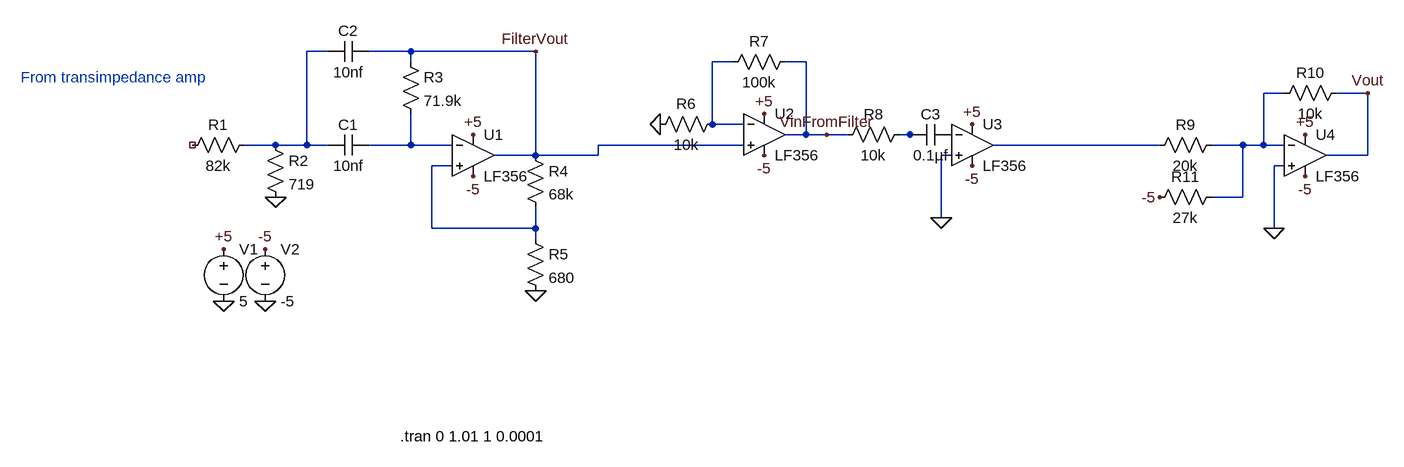
[diagram p0: schematic SecondOrderFilter.asc]
SecondOrderFilter.asc, the LTspice schematic file:
Version 4
SHEET 1 1868 680
WIRE 224 -16 192 -16
WIRE 352 -16 288 -16
WIRE 544 -16 352 -16
WIRE 352 0 352 -16
WIRE 848 0 816 0
WIRE 960 0 928 0
WIRE 1696 48 1664 48
WIRE 1824 48 1776 48
WIRE 816 96 816 0
WIRE 864 96 816 96
WIRE 960 112 960 0
WIRE 960 112 928 112
WIRE 992 112 960 112
WIRE 1024 112 992 112
WIRE 1120 112 1104 112
WIRE 1136 112 1120 112
WIRE 144 128 96 128
WIRE 192 128 192 -16
WIRE 192 128 144 128
WIRE 224 128 192 128
WIRE 352 128 352 80
WIRE 352 128 288 128
WIRE 416 128 352 128
WIRE 864 128 640 128
WIRE 1504 128 1248 128
WIRE 1632 128 1584 128
WIRE 1664 128 1664 48
WIRE 1664 128 1632 128
WIRE 1696 128 1664 128
WIRE 544 144 544 -16
WIRE 544 144 480 144
WIRE 640 144 640 128
WIRE 640 144 544 144
WIRE 1184 144 1168 144
WIRE 1824 144 1824 48
WIRE 1824 144 1760 144
WIRE 416 160 384 160
WIRE 1696 160 1680 160
WIRE 1632 208 1632 128
WIRE 1632 208 1584 208
WIRE 1168 240 1168 144
WIRE 384 256 384 160
WIRE 544 256 544 224
WIRE 544 256 384 256
WIRE 1680 256 1680 160
WIRE 544 272 544 256
FLAG 544 352 0
FLAG 144 208 0
FLAG 128 368 0
FLAG 64 368 0
FLAG 64 288 +5
FLAG 128 288 -5
FLAG 448 176 -5
FLAG 448 112 +5
FLAG 544 -16 FilterVout
FLAG 736 96 0
FLAG 896 80 +5
FLAG 896 144 -5
FLAG 1168 240 0
FLAG 1680 256 0
FLAG 1216 160 -5
FLAG 1504 208 -5
FLAG 1728 176 -5
FLAG 1216 96 +5
FLAG 1728 112 +5
FLAG 1824 48 Vout
FLAG 992 112 VinFromFilter
SYMBOL res 112 112 R90
WINDOW 0 0 56 VBottom 2
WINDOW 3 32 56 VTop 2
SYMATTR InstName R1
SYMATTR Value 82k
SYMBOL res 128 112 R0
SYMATTR InstName R2
SYMATTR Value 719
SYMBOL cap 288 112 R90
WINDOW 0 0 32 VBottom 2
WINDOW 3 32 32 VTop 2
SYMATTR InstName C1
SYMATTR Value 10nf
SYMBOL cap 288 -32 R90
WINDOW 0 0 32 VBottom 2
WINDOW 3 32 32 VTop 2
SYMATTR InstName C2
SYMATTR Value 10nf
SYMBOL res 336 -16 R0
SYMATTR InstName R3
SYMATTR Value 71.9k
SYMBOL OpAmps\\LF356 448 80 R0
SYMATTR InstName U1
SYMBOL res 528 128 R0
SYMATTR InstName R4
SYMATTR Value 68k
SYMBOL res 528 256 R0
SYMATTR InstName R5
SYMATTR Value 680
SYMBOL voltage 64 272 R0
WINDOW 123 0 0 Left 0
WINDOW 39 0 0 Left 0
SYMATTR InstName V1
SYMATTR Value 5
SYMBOL voltage 128 272 R0
WINDOW 123 0 0 Left 0
WINDOW 39 0 0 Left 0
SYMATTR InstName V2
SYMATTR Value -5
SYMBOL OpAmps\\LF356 896 48 R0
SYMATTR InstName U2
SYMBOL res 832 80 R90
WINDOW 0 0 56 VBottom 2
WINDOW 3 32 56 VTop 2
SYMATTR InstName R6
SYMATTR Value 10k
SYMBOL res 944 -16 R90
WINDOW 0 0 56 VBottom 2
WINDOW 3 32 56 VTop 2
SYMATTR InstName R7
SYMATTR Value 100k
SYMBOL res 1120 96 R90
WINDOW 0 0 56 VBottom 2
WINDOW 3 32 56 VTop 2
SYMATTR InstName R8
SYMATTR Value 10k
SYMBOL cap 1184 96 R90
WINDOW 0 0 32 VBottom 2
WINDOW 3 32 32 VTop 2
SYMATTR InstName C3
SYMATTR Value 0.1µf
SYMBOL OpAmps\\LF356 1216 64 R0
SYMATTR InstName U3
SYMBOL res 1600 112 R90
WINDOW 0 0 56 VBottom 2
WINDOW 3 32 56 VTop 2
SYMATTR InstName R9
SYMATTR Value 20k
SYMBOL res 1600 192 R90
WINDOW 0 0 56 VBottom 2
WINDOW 3 32 56 VTop 2
SYMATTR InstName R11
SYMATTR Value 27k
SYMBOL OpAmps\\LF356 1728 80 R0
SYMATTR InstName U4
SYMBOL res 1792 32 R90
WINDOW 0 0 56 VBottom 2
WINDOW 3 32 56 VTop 2
SYMATTR InstName R10
SYMATTR Value 10k
TEXT -248 24 Left 2 ;From transimpedance amp
TEXT 336 576 Left 2 !.tran 0 1.01 1 0.0001

The netlist it stands for:
* SecondOrderFilter.asc
R1 N001 NC_01 82k
R2 N001 0 719
C1 N005 N001 10nf
C2 FilterVout N001 10nf
R3 FilterVout N005 71.9k
XU1 N007 N005 +5 -5 FilterVout LF356  ; pins In+ In- V+ V- OUT
R4 FilterVout N007 68k
R5 N007 0 680
V1 +5 0 5
V2 -5 0 -5
XU2 FilterVout N002 +5 -5 VinFromFilter LF356  ; pins In+ In- V+ V- OUT
R6 N002 0 10k
R7 VinFromFilter N002 100k
R8 N004 VinFromFilter 10k
C3 P001 N004 0.1µf
XU3 0 P001 +5 -5 N006 LF356  ; pins In+ In- V+ V- OUT
R9 N003 N006 20k
R11 N003 -5 27k
XU4 0 N003 +5 -5 Vout LF356  ; pins In+ In- V+ V- OUT
R10 Vout N003 10k
* From transimpedance amp
.tran 0 1.01 1 0.0001
.lib LF356.sub
.backanno
.end